# EAGLE design Arduino_Shield_RC_Controller_v2 (EAGLE 9.6.2)
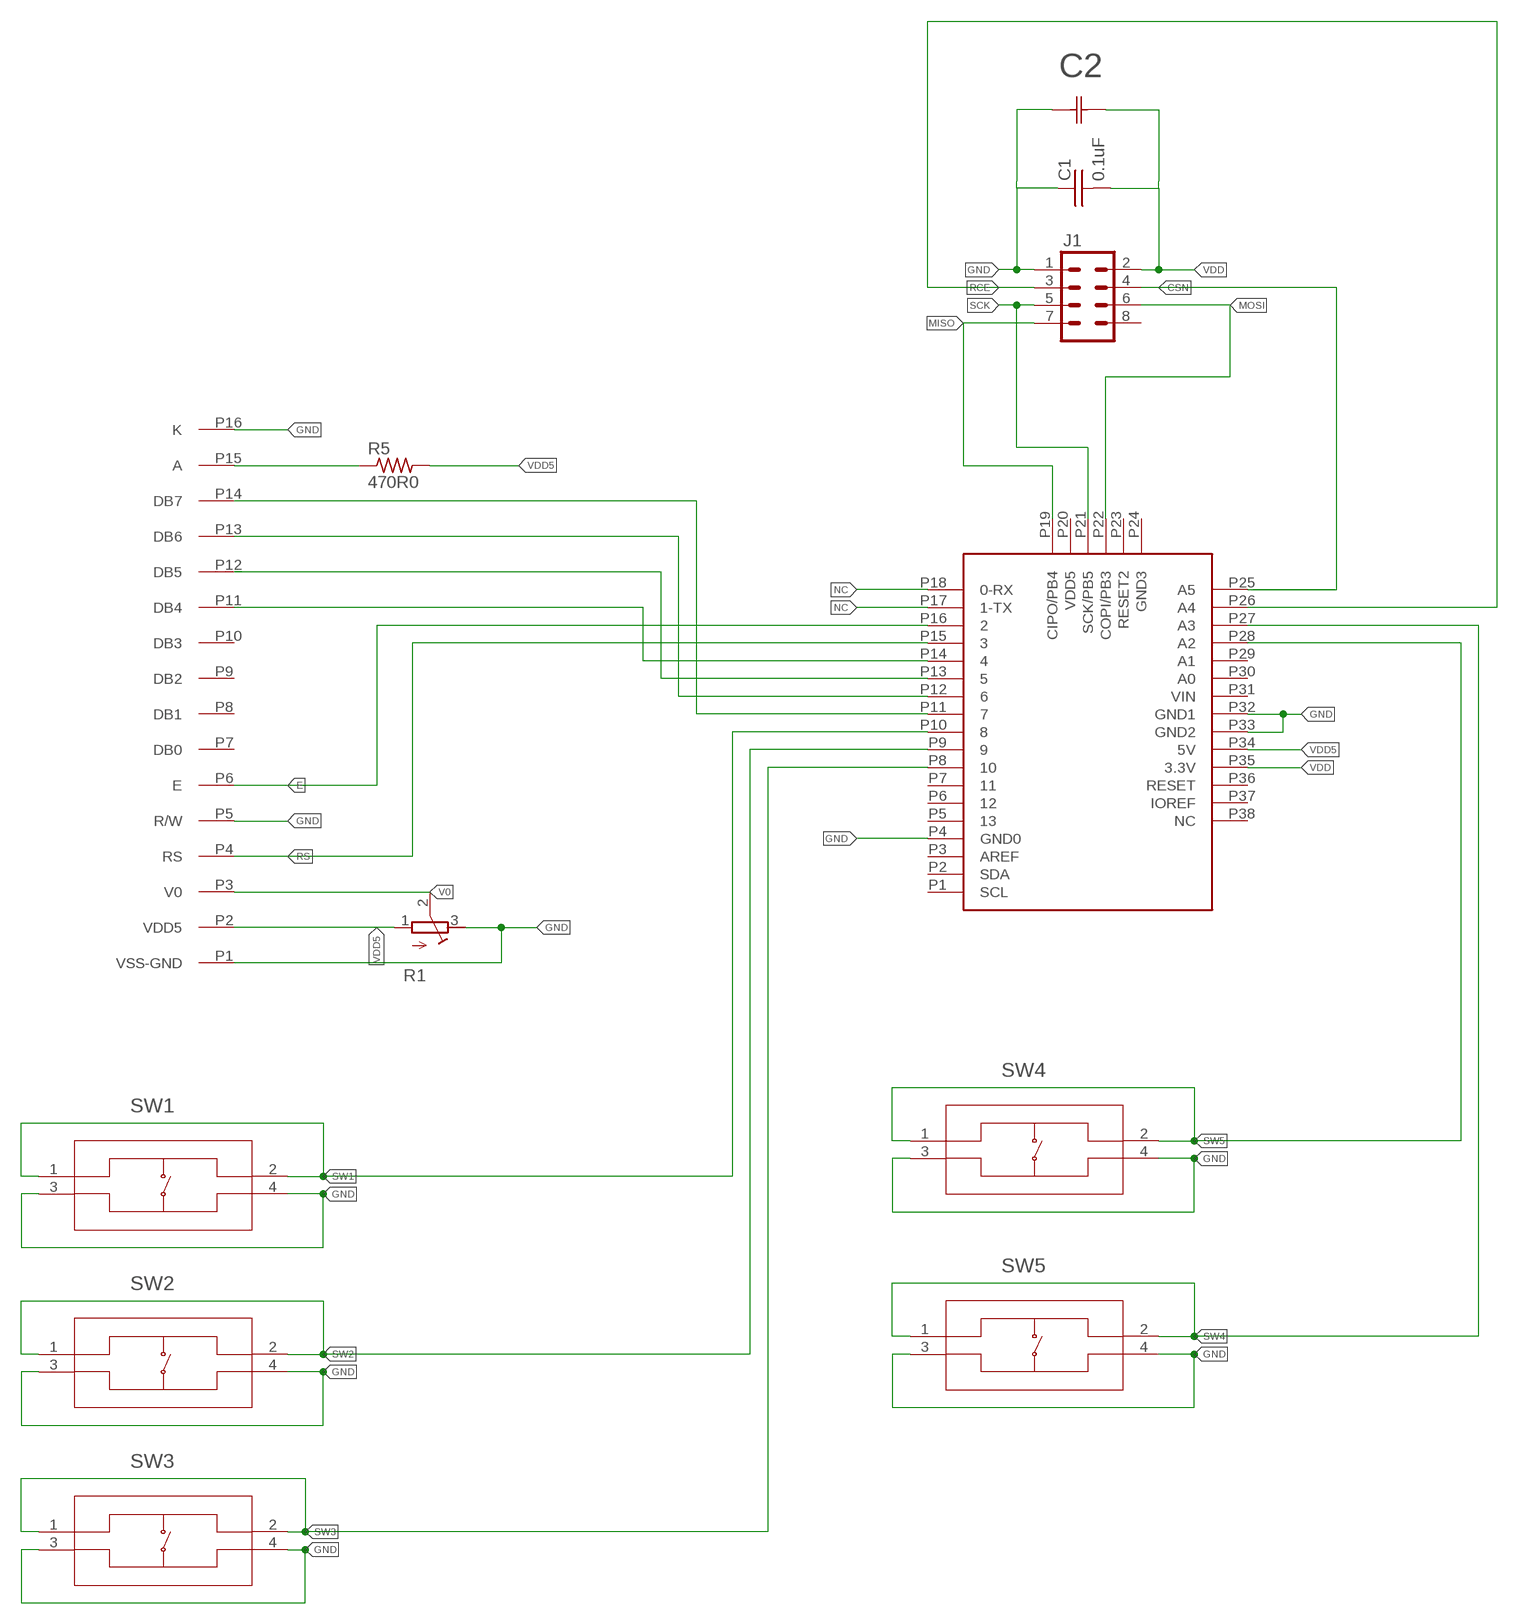
[diagram p0: schematic, sheet 1]

## Parts
AR1  ARDUINO_R3  [ARDUINO_R3]
C1  0.1uF  C_0402_0.1UF  [0402]
C2  CAP_470UF_RAD_TH  [CAP_YX_10X16_RUB]
J1  CONN_04X2  [2X4]
LCD1  ADM1602K  [ADM1602K]
R1  R-TRIMM3103  [RTRIM3103]
R5  470R0  R_0402_470R0  [0402]
SW1  PTS810SJG250SMTRLFS  [PTS810]
SW2  PTS810SJG250SMTRLFS  [PTS810]
SW3  PTS810SJG250SMTRLFS  [PTS810]
SW4  PTS810SJG250SMTRLFS  [PTS810]
SW5  PTS810SJG250SMTRLFS  [PTS810]

## Nets
CSN: AR1.P25(A5) J1.4
E: AR1.P16 LCD1.P6(E)
GND: AR1.P4(GND0) AR1.P32(GND1) AR1.P33(GND2) C1.P$1 C2.1 J1.1 LCD1.P1(VSS-GND) LCD1.P5(R/W) LCD1.P16(K) R1.3(E) SW1.3 SW1.4 SW2.3 SW2.4 SW3.3 SW3.4 SW4.3 SW4.4 SW5.3 SW5.4
MISO: AR1.P19(CIPO/PB4) J1.7
MOSI: AR1.P22(COPI/PB3) J1.6
N$3: AR1.P11 LCD1.P14(DB7)
N$4: AR1.P12 LCD1.P13(DB6)
N$5: AR1.P13 LCD1.P12(DB5)
N$6: AR1.P14 LCD1.P11(DB4)
N$39: LCD1.P15(A) R5.P$1
NC: AR1.P17(1-TX) AR1.P18(0-RX)
RCE: AR1.P26(A4) J1.3
RS: AR1.P15 LCD1.P4(RS)
SCK: AR1.P21(SCK/PB5) J1.5
SW1: AR1.P10 SW1.1 SW1.2
SW2: AR1.P9 SW2.1 SW2.2
SW3: AR1.P8 SW3.1 SW3.2
SW4: AR1.P27(A3) SW5.1 SW5.2
SW5: AR1.P28(A2) SW4.1 SW4.2
V0: LCD1.P3(V0) R1.2(S)
VDD: AR1.P35(3.3V) C1.P$2 C2.2 J1.2
VDD5: AR1.P34(5V) LCD1.P2(VDD5) R1.1(A) R5.P$2
Unconnected: AR1.P1(SCL) AR1.P2(SDA) AR1.P3(AREF) AR1.P5 AR1.P6 AR1.P7 AR1.P20(VDD5) AR1.P23(RESET2) AR1.P24(GND3) AR1.P29(A1) AR1.P30(A0) AR1.P31(VIN) AR1.P36(RESET) AR1.P37(IOREF) AR1.P38(NC) J1.8 LCD1.P7(DB0) LCD1.P8(DB1) LCD1.P9(DB2) LCD1.P10(DB3)

## Library data of the parts
AR1 = 3D_MIG_Controller:ARDUINO_R3
C1 = 3D_MIG_Controller:C_0402_0.1UF; PARTNO: CL05F104ZO5NNNC
C2 = 3D_MIG_Controller:CAP_470UF_RAD_TH; COPYRIGHT: Copyright (C) 2023 Ultra Librarian. All rights reserved.; DIGIKEY_PART_NUMBER_1: 1189-1890-ND; MANUFACTURER_PART_NUMBER: 35ZLH470MEFC10X16; MFR_NAME: Rubycon
J1 = 3D_MIG_Controller:CONN_04X2: Multi connection point. Often used as Generic Header-pin footprint for 0.1 inch spaced/style header connections For AVR SPI programming port, see special device with nice symbol: "AVR_SPI_PROG_5x2.dev" You can populate with any combo of single row headers, but if you'd like an exact match, check these: 2x5 AVR ICSP Male Header <https://www.sparkfun.com/products/778> (PRT-00778) 2x5 Pin Shrouded Header <https://www.sparkfun.com/products/8506> (PRT-08506) On any of the 0.1 inch spaced packages, you can populate with these: Break Away Headers - Straight <https://www.sparkfun.com/products/116> (PRT-00116) Break Away Male Headers - Right Angle <https://www.sparkfun.com/products/553> (PRT-00553) Female Headers <https://www.sparkfun.com/products/115> (PRT-00115) Break Away Headers - Machine Pin <https://www.sparkfun.com/products/117> (PRT-00117) Break Away Female Headers - Swiss Machine Pin <https://www.sparkfun.com/products/743> (PRT-00743) Special note: the shrouded connector mates well with our 5x2 ribbon cables: 2x5 Pin IDC Ribbon Cable <https://www.sparkfun.com/products/8535> (PRT-08535)
LCD1 = 3D_MIG_Controller:ADM1602K
R1 = 3D_MIG_Controller:R-TRIMM: Trimm resistor
R5 = 3D_MIG_Controller:R_0402_470R0; PARTNO: RMCF0402JT470R
SW1-SW5 = 3D_MIG_Controller:PTS810SJG250SMTRLFS; BUILT_BY: EMA_Cory; COPYRIGHT: Copyright (C) 2018 Accelerated Designs. All rights reserved; DATASHEET: https://www.ckswitches.com/products/tactile/PTS810/#PTS810SJG250SMTRLFS; MANUFACTURER_PART_NUMBER: PTS810SJG250SMTRLFS; VENDOR: C&K

## Board
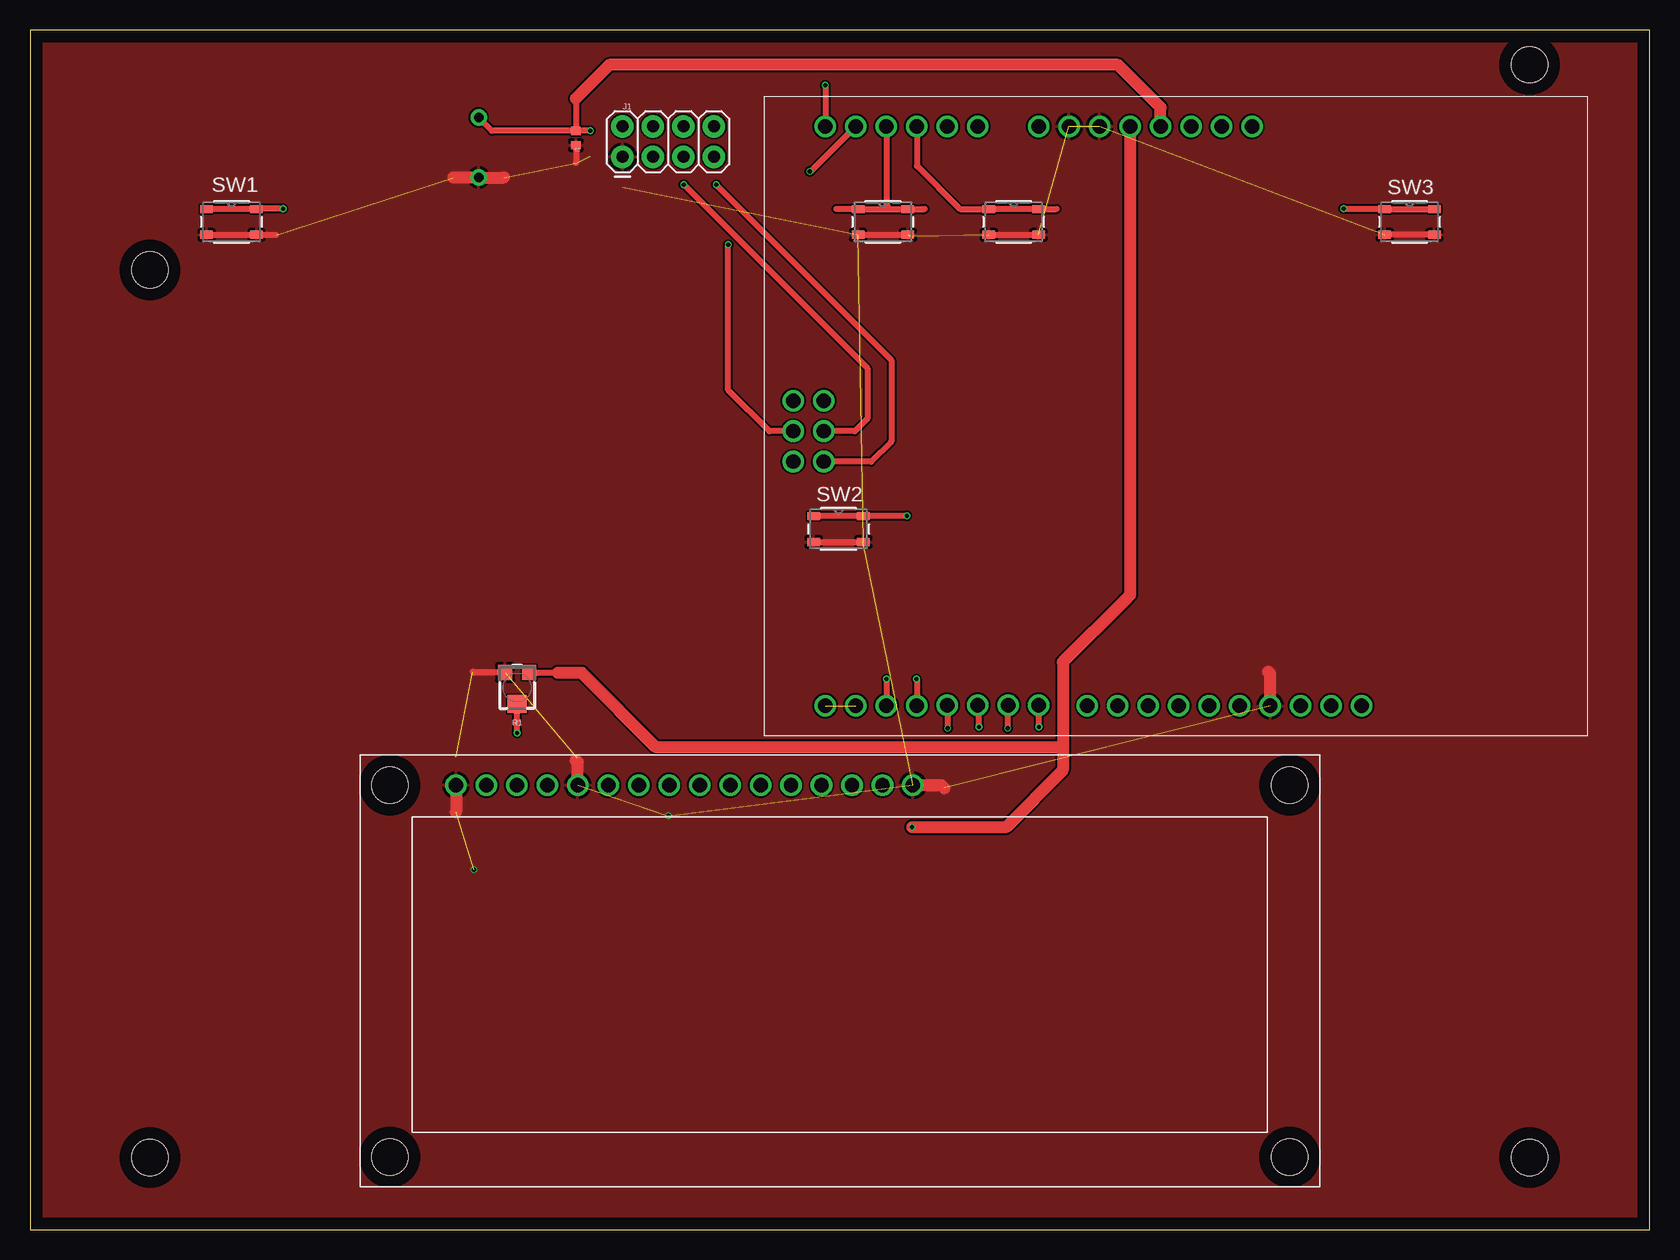
[diagram p1: board, top side]
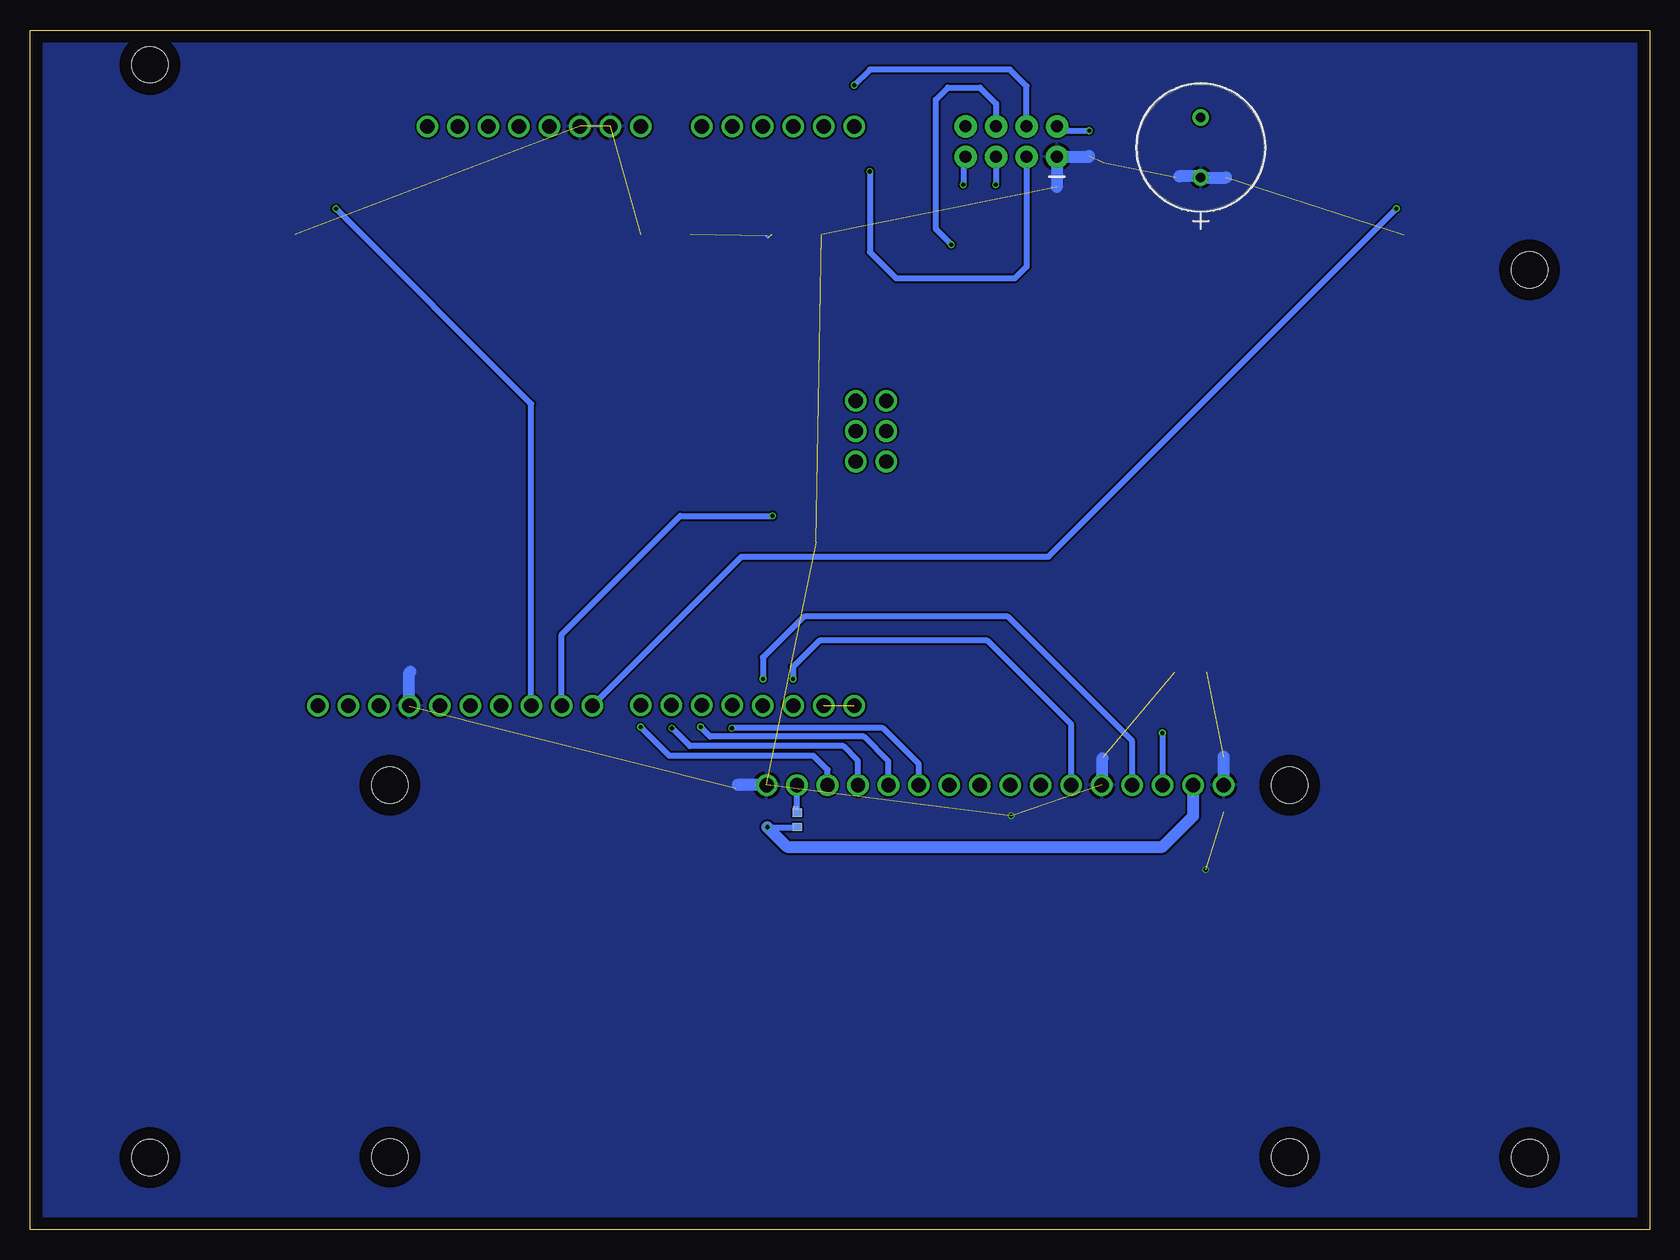
[diagram p2: board, bottom side, seen from below]

Size 135 x 100 mm. Coordinates in mm from the lower left corner, seen from the top.
Outline: 0,0 135,0 135,100 0,100 0,0
Copper layers (1*16): Top 0.035mm / dielectric 1.5mm / Bottom 0.035mm
Design rules "default *": minimum track width 6mil, minimum drill 0.2mm, track to track 6mil, track to pad 6mil, pad to pad 6mil, via to via 6mil, smd to smd 6mil, copper to edge 40mil, drill to drill 6mil, minimum pad ring 10mil, minimum via ring 4mil, stop-mask expansion 4mil, vias tented up to drill 0mil, thermal gap 10mil
Holes 3 mm at 10,6 125,6 125,97.1 10,80

### Footprints (pad centres in the part's own frame; a part is rotated, then mirrored left to right if it is on the bottom)
ARDUINO_R3 = drill 1.2: P1 18.8,50.84; P2 21.34,50.84; P3 23.88,50.84; P4 26.42,50.84; P5 28.96,50.84; P6 31.5,50.84; P7 34.04,50.84; P8 36.58,50.84; P9 39.12,50.84; P10 41.66,50.84; P11 45.72,50.8; P12 48.26,50.8; P13 50.8,50.8; P14 53.34,50.8; P15 55.88,50.84; P16 58.42,50.84; P17 60.96,50.84; P18 63.5,50.84; P19 63.627,30.48; P20 66.167,30.48; P21 63.627,27.94; P22 66.167,27.94; P23 63.627,25.4; P24 66.167,25.4; P25 63.5,2.54; P26 60.96,2.54; P27 58.42,2.54; P28 55.88,2.54; P29 53.34,2.54; P30 50.8,2.54; P31 45.72,2.54; P32 43.18,2.54; P33 40.64,2.54; P34 38.1,2.54; P35 35.56,2.54; P36 33.02,2.54; P37 30.48,2.54; P38 27.94,2.54
0402 = smd 0.8 x 0.7: P$1 0,0.6; P$2 0,-0.6
CAP_YX_10X16_RUB = drill 0.795 pad 1.372: 1 0,0; 2 5.004,0
2X4 = drill 1 pad 1.88: 1 -3.81,-1.27; 2 -3.81,1.27; 3 -1.27,-1.27; 4 -1.27,1.27; 5 1.27,-1.27; 6 1.27,1.27; 7 3.81,-1.27; 8 3.81,1.27
ADM1602K = drill 1.2: P1 -32,15.5; P2 -29.46,15.5; P3 -26.92,15.5; P4 -24.38,15.5; P5 -21.84,15.5; P6 -19.3,15.5; P7 -16.76,15.5; P8 -14.22,15.5; P9 -11.68,15.5; P10 -9.14,15.5; P11 -6.6,15.5; P12 -4.06,15.5; P13 -1.52,15.5; P14 1.02,15.5; P15 3.56,15.5; P16 6.1,15.5 | hole 3: -37.5,-15.5; 37.5,-15.5; 37.5,15.5; -37.5,15.5
RTRIM3103 = smd 1.2 x 1.25: 1 -1,-1.225; 3 1,-1.225 | smd 1.6 x 1.5: 2 0,1.4
PTS810 = smd 1.041 x 0.66: 1 -2.075,1.075; 2 2.075,1.075; 3 -2.075,-1.075; 4 2.075,-1.075

### Placement (x,y rotation side)
AR1  129.8,94.5 180 top
C1  45.5,91 180 top
C2  37.4,87.7 90 bottom
J1  53.2,90.7 0 top
LCD1  67.5,21.55 0 top
R1  40.6,45.2 180 top
R5  71.05,34.16 0 bottom
SW1  16.8,84 0 top
SW2  67.4,58.4 0 top
SW3  115,84 0 top
SW4  82,84 0 top
SW5  71.1,84 0 top

### Tracks (layer width: path | path; a pad name or v marks a point on that pad's centre or on a via)
CSN  (via drill 0.35)
  Top 0.508: v66.3,95.4 AR1.P25
  Bottom 0.508: J1.4 51.93,95.33 53.3,96.7 65,96.7 v66.3,95.4
E  (via drill 0.35)
  Top 0.508: v71.4,45.9 71.4,43.68 AR1.P16
  Bottom 0.508: LCD1.P6 48.2,42.1 55.2,49.1 69.2,49.1 71.4,46.9 v71.4,45.9
GND  (via drill 0.35)  (17 unrouted)
  Top 0.254: 69.45,57.3 SW2.4
  Top 0.508: SW3.4 SW3.3 | SW2.3 SW2.4 | SW1.3 SW1.4 20.48,82.92 20.5,82.9 | R1.3 36.98,46.42 36.9,46.5 | SW5.3 SW5.4 | SW4.3 SW4.4 | C1.P$1 45.5,88.9
  Top 1.016: LCD1.P1 35.5,34.8 | LCD1.P16 75.95,37.05 76.2,36.8 | LCD1.P5 45.66,38.94 45.5,39.1 | AR1.P4 103.38,46.32 103.2,46.5 | 39.5,87.7 C2.1 35.3,87.7
  Bottom 0.254: 73.6,82.8 73.5,82.7
  Bottom 1.016: LCD1.P1 35.5,39.4 | LCD1.P5 45.6,37.11 45.6,39.3 | LCD1.P16 75.95,37.05 76,37.1 | AR1.P4 103.38,46.42 103.3,46.5 | 49.4,86.9 J1.1 46.77,89.43 46.7,89.5 | 35.3,87.7 C2.1 37.5,87.8 39.2,87.8
  other vias: 37,30 53.2,34.5
  pour Top: 0,100.3 135,100.3 135,0 0,0
  pour Bottom: 0,100.2 135,100.2 135,0 0,0
MISO  (via drill 0.35)
  Top 0.508: v57.2,87.1 71.8,72.5 71.8,65.7 70.12,64.02 AR1.P19
  Bottom 0.508: J1.7 57.2,89.24 v57.2,87.1
MOSI  (via drill 0.35)
  Top 0.508: AR1.P22 61.64,66.56 58.2,70 v58.2,82.1
  Bottom 0.508: v58.2,82.1 59.5,83.4 59.5,94.2 58.5,95.2 55.8,95.2 54.47,93.87 J1.6
N$3  (via drill 0.35)
  Top 0.508: v84.1,41.9 84.1,43.68 AR1.P11
  Bottom 0.508: LCD1.P14 68.52,38.32 69.7,39.5 81.7,39.5 v84.1,41.9
N$4  (via drill 0.35)
  Top 0.508: v81.5,41.8 81.5,43.66 AR1.P12
  Bottom 0.508: LCD1.P13 65.98,39.08 67.2,40.3 80,40.3 v81.5,41.8
N$5  (via drill 0.35)
  Top 0.508: v79.1,41.9 79.1,43.6 AR1.P13
  Bottom 0.508: LCD1.P12 63.44,39.04 65.5,41.1 78.3,41.1 v79.1,41.9
N$6  (via drill 0.35)
  Top 0.508: v76.5,41.8 76.5,43.66 AR1.P14
  Bottom 0.508: LCD1.P11 60.9,38.8 63.9,41.8 v76.5,41.8
N$39
  Bottom 0.508: R5.P$1 LCD1.P15
NC  (1 unrouted)
RCE  (via drill 0.35)
  Top 0.508: AR1.P26 65.08,88.2 v65,88.2
  Bottom 0.508: J1.3 51.93,80.27 52.9,79.3 62.8,79.3 65,81.5 v65,88.2
RS  (via drill 0.35)
  Top 0.508: v73.9,45.9 73.92,45.88 AR1.P15
  Bottom 0.508: LCD1.P4 43.12,40.72 53.5,51.1 70.5,51.1 73.9,47.7 v73.9,45.9
SCK  (via drill 0.35)
  Top 0.508: v54.5,87.1 69.8,71.8 69.8,67.6 68.76,66.56 AR1.P21
  Bottom 0.508: J1.5 54.47,87.13 v54.5,87.1
SW1  (via drill 0.35)
  Top 0.508: v21.1,85.1 18.9,85.1 SW1.2 SW1.1
  Bottom 0.508: AR1.P10 75.7,56.1 50.1,56.1 v21.1,85.1
SW2  (via drill 0.35)
  Top 0.508: v73.1,59.5 69.5,59.5 SW2.2 SW2.1
  Top 0.61: SW2.1
  Bottom 0.508: AR1.P9 90.68,49.62 80.8,59.5 v73.1,59.5
SW3  (via drill 0.35)
  Top 0.508: v109.5,85.1 112.9,85.1 SW3.1 SW3.2
  Bottom 0.508: AR1.P8 93.22,68.82 v109.5,85.1
SW4
  Top 0.508: 71.7,85.08 SW5.1 67.22,85.08 | SW5.2 74.6,85.08 | 71.7,85.08 SW5.2 | SW5.2 74.38,85.08 | AR1.P27 71.38,85.39 71.7,85.08
SW5
  Top 0.508: 85.58,85.08 SW4.2 SW4.1 77.53,85.08 73.92,88.68 AR1.P28
V0  (via drill 0.35)
  Top 0.508: v40.6,41.4 R1.2
  Bottom 0.508: LCD1.P3 40.58,41.38 v40.6,41.4
VDD  (via drill 0.35)
  Top 0.508: C1.P$2 45.6,91.7 | 45.5,94.3 C1.P$2 | C1.P$2 38.5,91.6 C2.2 | v46.7,91.6 C1.P$2
  Top 1.016: AR1.P35 94.24,93.56 90.7,97.1 48.3,97.1 45.5,94.3
  Bottom 0.508: J1.2 49.02,91.6 v46.7,91.6
VDD5  (via drill 0.35)
  Top 0.508: 44,46.4 41.62,46.4 R1.1
  Top 1.016: 86.1,40.2 86.1,47.3 91.25,52.45 91.7,52.9 AR1.P34 | 86.1,40.2 86.1,38.3 81.34,33.54 v73.53,33.54 | 86.1,40.2 52.2,40.2 46,46.4 44,46.4
  Bottom 0.508: v73.53,33.54 71.07,33.54 R5.P$2
  Bottom 1.016: v73.53,33.54 71.89,31.9 40.6,31.9 38.04,34.46 LCD1.P2